# Altium schematic sheet panels_connections.SchDoc: Panel connectors
size A4; Author: Michał Gumiela
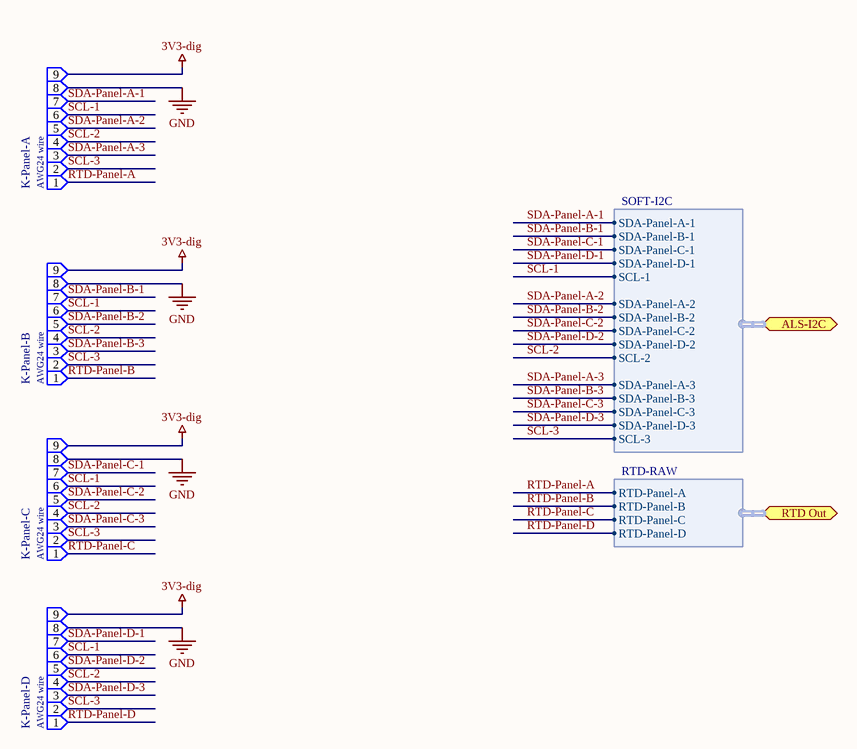
[diagram p0: panels_connections.SchDoc]

## Parts
K-Panel-A  AWG24 wire  [wire-awg26-9_stress-relief]
K-Panel-B  AWG24 wire  [wire-awg26-9_stress-relief]
K-Panel-C  AWG24 wire  [wire-awg26-9_stress-relief]
K-Panel-D  AWG24 wire  [wire-awg26-9_stress-relief]

## Ports
ALS-I2C (harness SOFT-I2C), RTD Out (harness RTD-RAW)

## Harnesses
SOFT-I2C: SDA-Panel-A-1, SDA-Panel-D-1, SDA-Panel-B-1, SDA-Panel-C-1, SCL-1, SDA-Panel-A-2, SDA-Panel-D-2, SDA-Panel-B-2, SDA-Panel-C-2, SCL-2, SDA-Panel-A-3, SDA-Panel-D-3, SDA-Panel-B-3, SDA-Panel-C-3, SCL-3
RTD-RAW: RTD-Panel-A, RTD-Panel-B, RTD-Panel-C, RTD-Panel-D

## Nets
3V3-dig: K-Panel-A.9 K-Panel-B.9 K-Panel-C.9 K-Panel-D.9
GND: K-Panel-A.8 K-Panel-B.8 K-Panel-C.8 K-Panel-D.8
RTD-Panel-A: K-Panel-A.1 ; port RTD Out.RTD-Panel-A
RTD-Panel-B: K-Panel-B.1 ; port RTD Out.RTD-Panel-B
RTD-Panel-C: K-Panel-C.1 ; port RTD Out.RTD-Panel-C
RTD-Panel-D: K-Panel-D.1 ; port RTD Out.RTD-Panel-D
SCL-1: K-Panel-A.6 K-Panel-B.6 K-Panel-C.6 K-Panel-D.6 ; port ALS-I2C.SCL-1
SCL-2: K-Panel-A.4 K-Panel-B.4 K-Panel-C.4 K-Panel-D.4 ; port ALS-I2C.SCL-2
SCL-3: K-Panel-A.2 K-Panel-B.2 K-Panel-C.2 K-Panel-D.2 ; port ALS-I2C.SCL-3
SDA-Panel-A-1: K-Panel-A.7 ; port ALS-I2C.SDA-Panel-A-1
SDA-Panel-A-2: K-Panel-A.5 ; port ALS-I2C.SDA-Panel-A-2
SDA-Panel-A-3: K-Panel-A.3 ; port ALS-I2C.SDA-Panel-A-3
SDA-Panel-B-1: K-Panel-B.7 ; port ALS-I2C.SDA-Panel-B-1
SDA-Panel-B-2: K-Panel-B.5 ; port ALS-I2C.SDA-Panel-B-2
SDA-Panel-B-3: K-Panel-B.3 ; port ALS-I2C.SDA-Panel-B-3
SDA-Panel-C-1: K-Panel-C.7 ; port ALS-I2C.SDA-Panel-C-1
SDA-Panel-C-2: K-Panel-C.5 ; port ALS-I2C.SDA-Panel-C-2
SDA-Panel-C-3: K-Panel-C.3 ; port ALS-I2C.SDA-Panel-C-3
SDA-Panel-D-1: K-Panel-D.7 ; port ALS-I2C.SDA-Panel-D-1
SDA-Panel-D-2: K-Panel-D.5 ; port ALS-I2C.SDA-Panel-D-2
SDA-Panel-D-3: K-Panel-D.3 ; port ALS-I2C.SDA-Panel-D-3

## Notes on the sheet
- Title:
- Sheet:
- of
- Author:
- Model:
- Document Number:
- Checked by:
- Iss-Rev:
- Approved by:
- Date:
- File name:

## Library data of the parts
K-Panel-A K-Panel-B K-Panel-C K-Panel-D = wire-awg26-9: Single wire AWG26 solder point.; Value: AWG24 wire